# EAGLE design M903X (EAGLE 6.6.0)
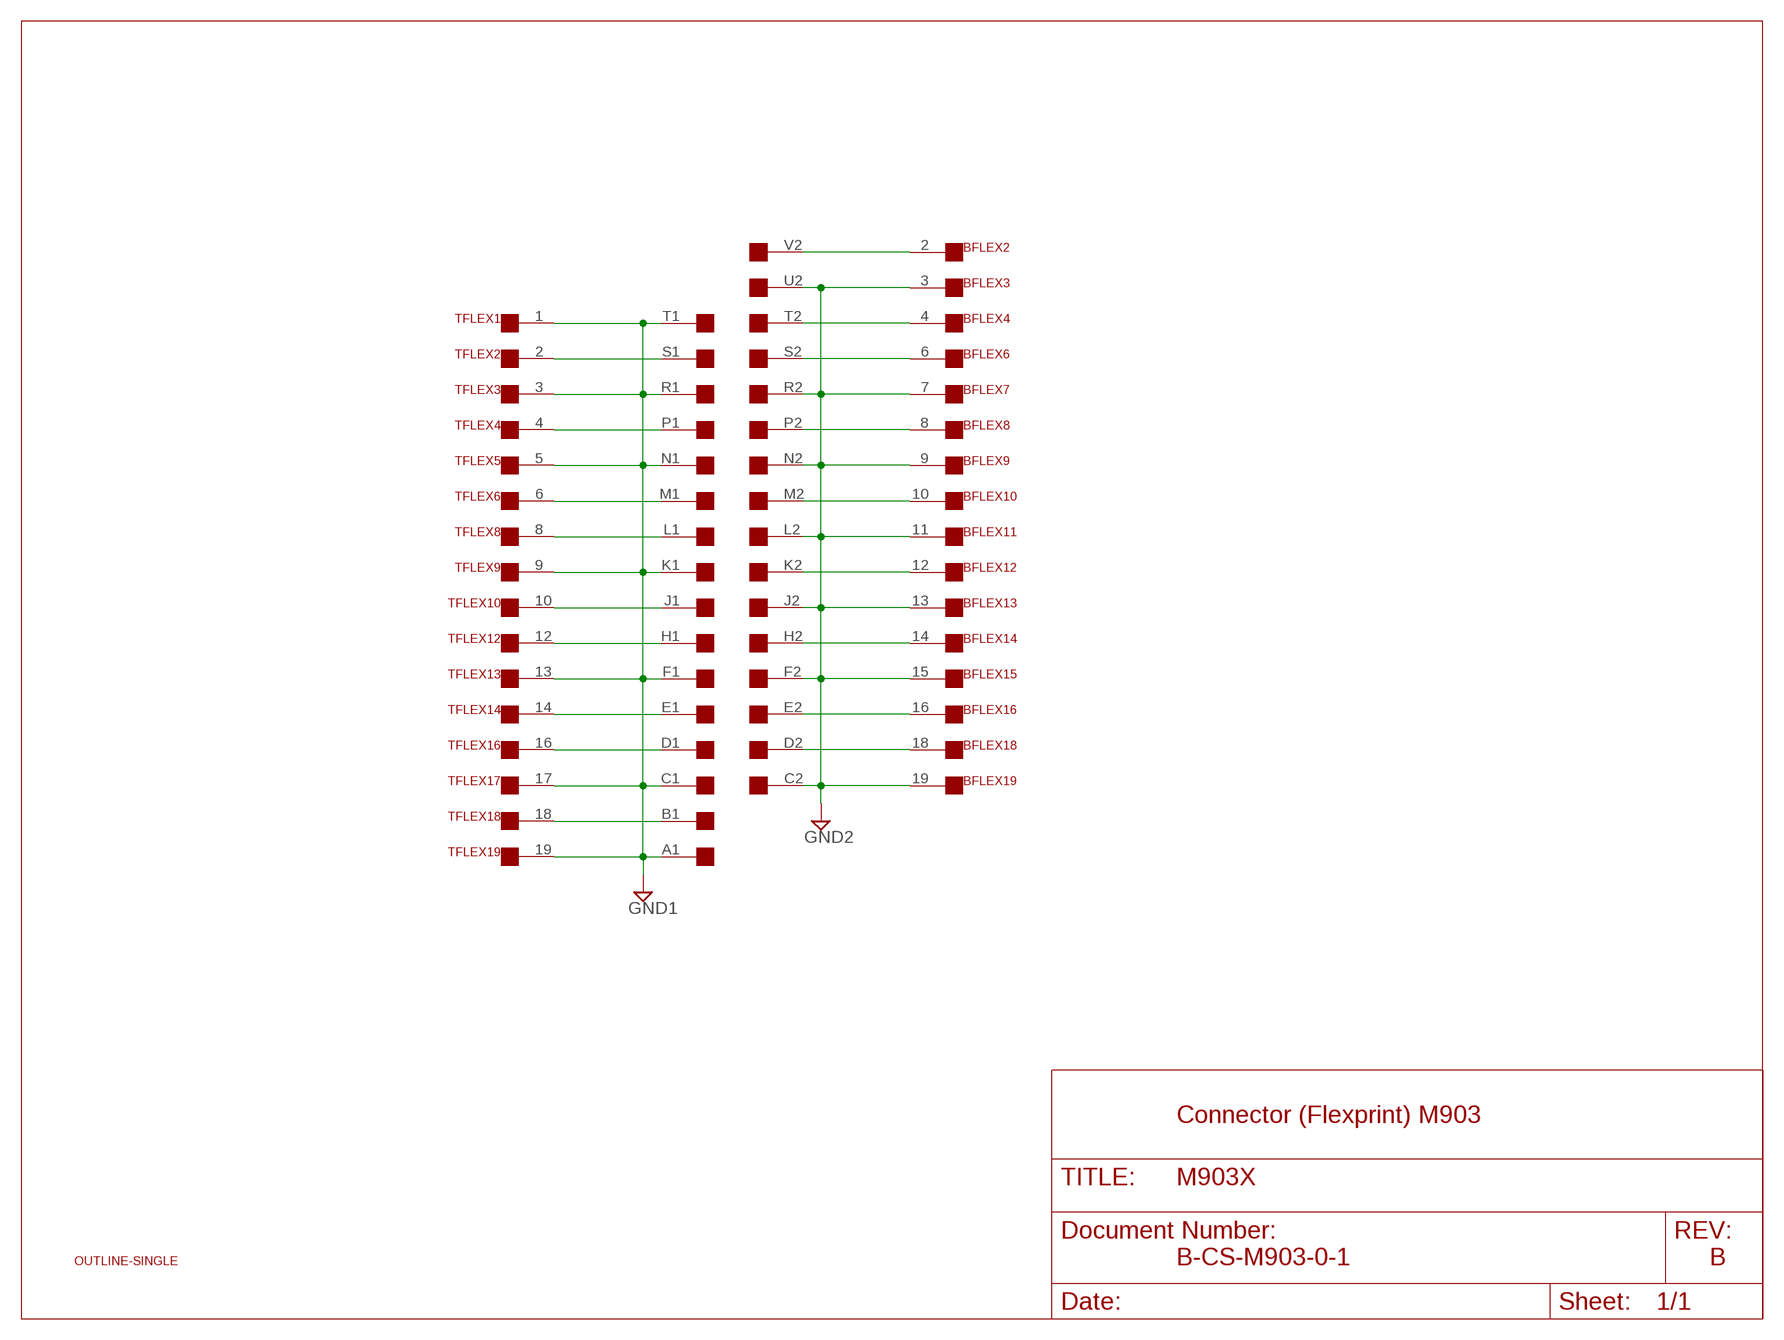
[diagram p0: schematic, sheet 1]

## Parts
BFLEX  FLEX19  [FLEX19]
TFLEX  FLEX19  [FLEX19]
U$1  SINGLE  [EDGE-CON2]
U$2  OUTLINE-SINGLE  [SINGLE]

## Nets
GND1: TFLEX.1 TFLEX.3 TFLEX.5 TFLEX.9 TFLEX.13 TFLEX.17 TFLEX.19 U$1.A1 U$1.C1 U$1.F1 U$1.K1 U$1.N1 U$1.R1 U$1.T1
GND2: BFLEX.3 BFLEX.7 BFLEX.9 BFLEX.11 BFLEX.13 BFLEX.15 BFLEX.19 U$1.C2 U$1.F2 U$1.J2 U$1.L2 U$1.N2 U$1.R2 U$1.U2
N$4: TFLEX.16 U$1.D1
N$5: TFLEX.14 U$1.E1
N$7: TFLEX.12 U$1.H1
N$8: TFLEX.10 U$1.J1
N$10: TFLEX.8 U$1.L1
N$11: TFLEX.6 U$1.M1
N$13: TFLEX.4 U$1.P1
N$15: TFLEX.2 U$1.S1
N$22: BFLEX.18 U$1.D2
N$23: BFLEX.16 U$1.E2
N$25: BFLEX.14 U$1.H2
N$27: BFLEX.12 U$1.K2
N$29: BFLEX.10 U$1.M2
N$31: BFLEX.8 U$1.P2
N$33: BFLEX.6 U$1.S2
N$34: BFLEX.4 U$1.T2
N$36: BFLEX.2 U$1.V2
N$42: TFLEX.18 U$1.B1
Unconnected: BFLEX.1 BFLEX.5 BFLEX.17 TFLEX.7 TFLEX.11 TFLEX.15 U$1.A2 U$1.B2 U$1.U1 U$1.V1

## Notes on the sheet
- Connector (Flexprint) M903
- B-CS-M903-0-1 | B

## Library data of the parts
BFLEX TFLEX = dec-con:FLEX19: 19 pin Flexprint Connection
U$1 = dec-con:SINGLE: Single-Height DEC board
U$2 = dec-con:OUTLINE-*: Board outlines for DEC boards.

## Board
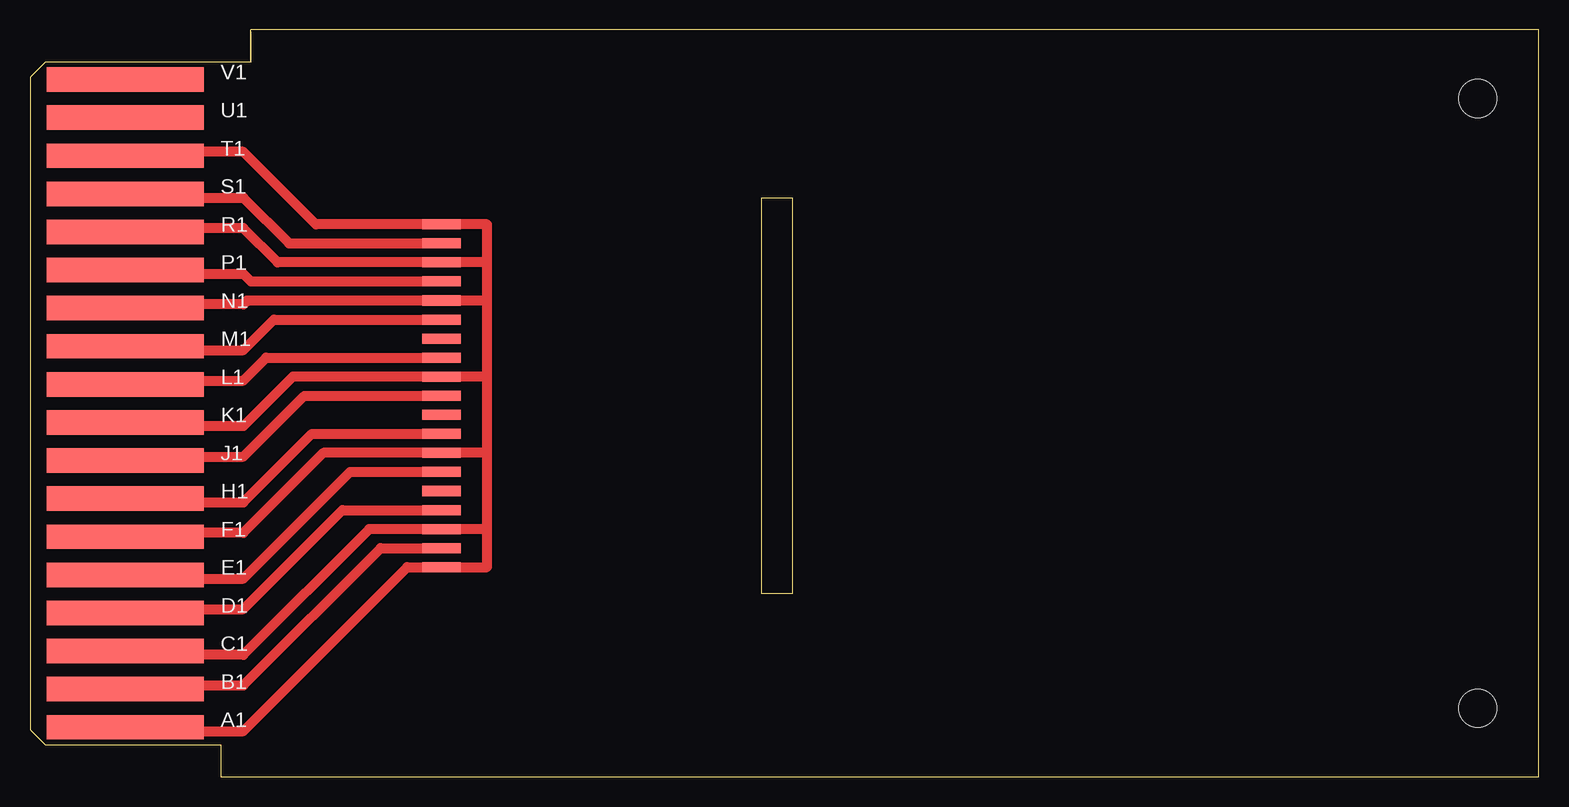
[diagram p1: board, top side]
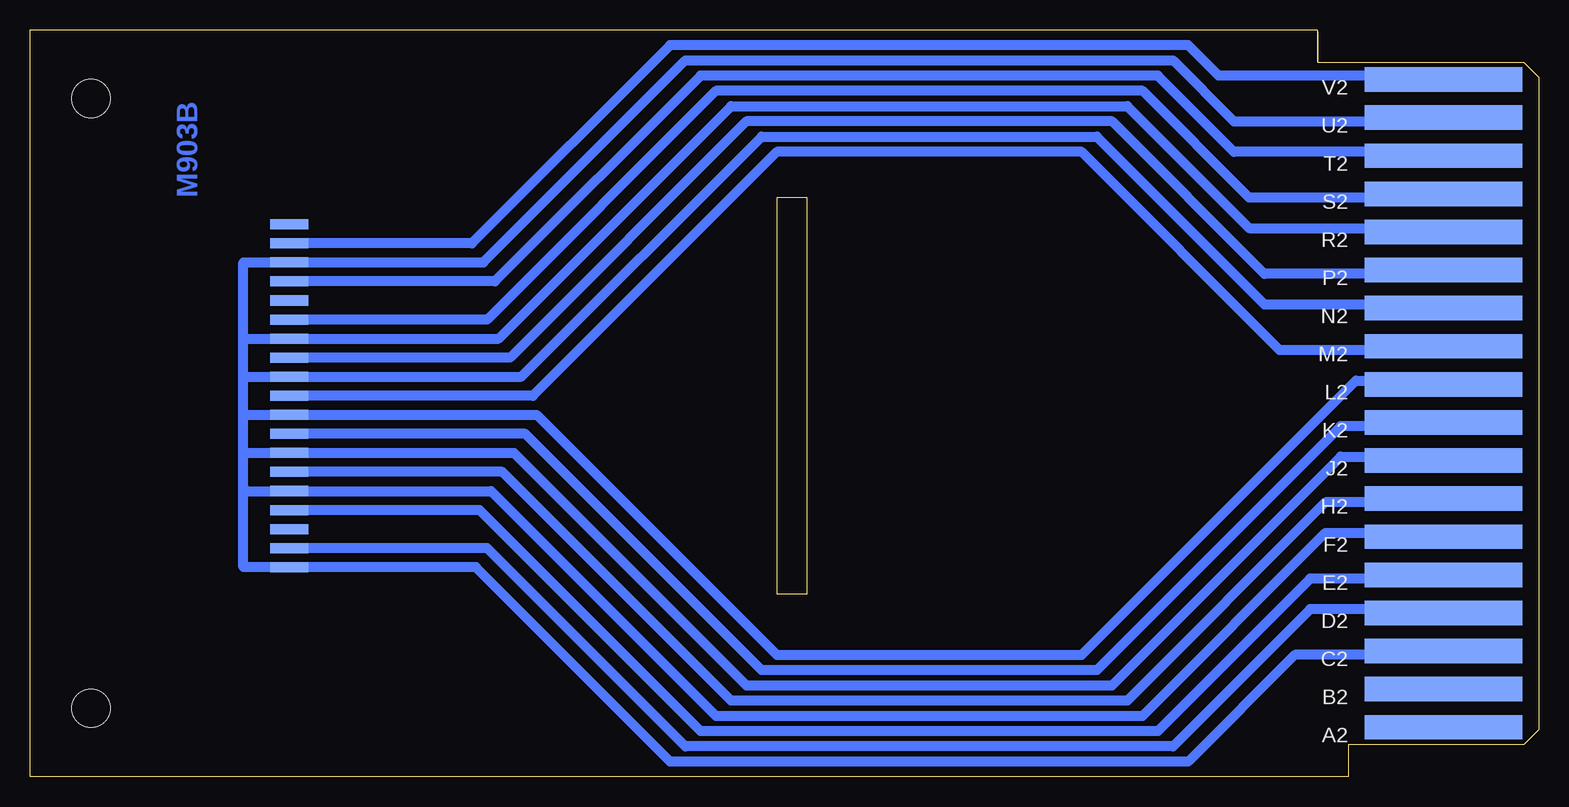
[diagram p2: board, bottom side, seen from below]

Size 125.73 x 62.23 mm. Coordinates in mm from the lower left corner, seen from the top.
Outline: 60.96,48.26 63.5,48.26 63.5,15.24 60.96,15.24 60.96,48.26
Copper layers (1+16): Top 0.035mm / dielectric 1.5mm / Bottom 0.035mm
Design rules "16mils": minimum track width 16mil, minimum drill 32mil, track to track 15mil, track to pad 10mil, pad to pad 10mil, via to via 10mil, smd to smd 10mil, copper to edge 13mil, drill to drill 10mil, minimum pad ring 10mil, minimum via ring 8mil, stop-mask expansion 0mil, vias tented up to drill 0mil, thermal gap 10mil

### Footprints (pad centres in the part's own frame; a part is rotated, then mirrored left to right if it is on the bottom)
FLEX19 = smd 3.175 x 0.838: 1 0,14.287; 2 0,12.7; 3 0,11.113; 4 0,9.525; 5 0,7.938; 6 0,6.35; 7 0,4.763; 8 0,3.175; 9 0,1.587; 10 0,0; 11 0,-1.587; 12 0,-3.175; 13 0,-4.763; 14 0,-6.35; 15 0,-7.938; 16 0,-9.525; 17 0,-11.113; 18 0,-12.7; 19 0,-14.287
EDGE-CON2 = smd 13.106 x 2.032: A1 7.938,4.128; B1 7.938,7.303; C1 7.938,10.477; D1 7.938,13.652; E1 7.938,16.828; F1 7.938,20.003; H1 7.938,23.177; J1 7.938,26.352; K1 7.938,29.527; L1 7.938,32.703; M1 7.938,35.877; N1 7.938,39.053; P1 7.938,42.227; R1 7.938,45.403; S1 7.938,48.578; T1 7.938,51.752; U1 7.938,54.928; V1 7.938,58.102 | smd 13.106 x 2.032 bottom: A2 7.938,4.128; B2 7.938,7.303; C2 7.938,10.477; D2 7.938,13.652; E2 7.938,16.828; F2 7.938,20.003; H2 7.938,23.177; J2 7.938,26.352; K2 7.938,29.527; L2 7.938,32.703; M2 7.938,35.877; N2 7.938,39.053; P2 7.938,42.227; R2 7.938,45.403; S2 7.938,48.578; T2 7.938,51.752; U2 7.938,54.928; V2 7.938,58.102
SINGLE = hole 3.175: 120.65,56.515; 120.65,5.715

### Placement (x,y rotation side)
BFLEX  104.14,31.75 0 bottom
TFLEX  34.29,31.75 0 top
U$1  0,0 0 top
U$2  0,0 0 top

### Tracks (layer width: path | path; a pad name or v marks a point on that pad's centre or on a via)
GND1
  Top 0.813: U$1.A1 8.26,3.81 17.78,3.81 31.43,17.46 TFLEX.19 38.1,17.46 38.1,20.64 | U$1.C1 8.26,10.16 17.78,10.16 28.26,20.64 TFLEX.17 38.1,20.64 | U$1.F1 8.26,20.32 17.78,20.32 24.45,26.99 TFLEX.13 38.1,26.99 | U$1.K1 8.26,29.21 17.78,29.21 21.91,33.34 TFLEX.9 38.1,33.34 | U$1.N1 8.26,39.37 17.78,39.37 18.1,39.69 TFLEX.5 38.1,39.69 | U$1.R1 8.26,45.72 17.78,45.72 20.64,42.86 TFLEX.3 38.1,42.86 | U$1.T1 8.26,52.07 17.78,52.07 23.81,46.04 TFLEX.1 38.1,46.04 38.1,42.86 | 38.1,20.64 38.1,26.99 | 38.1,26.99 38.1,33.34 | 38.1,33.34 38.1,39.69 | 38.1,39.69 38.1,42.86
GND2
  Bottom 0.813: U$1.C2 8.26,10.16 20.32,10.16 29.21,1.27 72.39,1.27 88.58,17.46 BFLEX.19 107.95,17.46 107.95,24.13 | U$1.F2 8.26,20.32 17.78,20.32 33.02,5.08 68.58,5.08 87.31,23.81 BFLEX.15 107.95,23.81 107.95,24.13 | U$1.J2 8.26,26.67 16.51,26.67 35.56,7.62 66.04,7.62 85.41,26.99 BFLEX.13 107.95,26.99 | U$1.L2 8.26,33.02 15.24,33.02 38.1,10.16 63.5,10.16 83.5,30.16 BFLEX.11 107.95,30.16 | U$1.N2 8.26,39.37 22.86,39.37 36.83,53.34 64.77,53.34 84.77,33.34 BFLEX.9 107.95,33.34 | U$1.R2 8.26,45.72 24.13,45.72 34.29,55.88 67.31,55.88 86.68,36.51 BFLEX.7 107.95,36.51 | U$1.U2 8.26,54.61 25.4,54.61 30.48,59.69 71.12,59.69 87.95,42.86 BFLEX.3 107.95,42.86 107.95,36.51 | 107.95,24.13 107.95,26.99 | 107.95,26.99 107.95,30.16 | 107.95,30.16 107.95,33.34 | 107.95,33.34 107.95,36.51
N$4
  Top 0.813: U$1.D1 8.26,13.97 17.78,13.97 26.04,22.23 TFLEX.16
N$5
  Top 0.813: U$1.E1 8.26,16.51 17.78,16.51 26.67,25.4 TFLEX.14
N$7
  Top 0.813: U$1.H1 8.26,22.86 17.78,22.86 23.5,28.57 TFLEX.12
N$8
  Top 0.813: U$1.J1 8.26,26.67 17.78,26.67 22.86,31.75 TFLEX.10
N$10
  Top 0.813: U$1.L1 8.26,33.02 17.78,33.02 19.69,34.92 TFLEX.8
N$11
  Top 0.813: U$1.M1 8.26,35.56 17.78,35.56 20.32,38.1 TFLEX.6
N$13
  Top 0.813: U$1.P1 8.26,41.91 17.78,41.91 18.42,41.27 TFLEX.4
N$15
  Top 0.813: U$1.S1 8.26,48.26 17.78,48.26 21.59,44.45 TFLEX.2
N$22
  Bottom 0.813: U$1.D2 8.26,13.97 19.05,13.97 30.48,2.54 71.12,2.54 87.63,19.05 BFLEX.18 104.46,19.05
N$23
  Bottom 0.813: U$1.E2 8.26,16.51 19.05,16.51 31.75,3.81 69.85,3.81 88.27,22.23 BFLEX.16
N$25
  Bottom 0.813: U$1.H2 8.26,22.86 17.78,22.86 34.29,6.35 67.31,6.35 86.36,25.4 BFLEX.14
N$27
  Bottom 0.813: U$1.K2 8.26,29.21 16.51,29.21 36.83,8.89 64.77,8.89 84.46,28.57 BFLEX.12
N$29
  Bottom 0.813: U$1.M2 8.26,35.56 21.59,35.56 38.1,52.07 63.5,52.07 83.82,31.75 BFLEX.10
N$31
  Bottom 0.813: U$1.P2 8.26,41.91 22.86,41.91 35.56,54.61 66.04,54.61 85.73,34.92 BFLEX.8
N$33
  Bottom 0.813: U$1.S2 8.26,48.26 24.13,48.26 33.02,57.15 68.58,57.15 87.63,38.1 BFLEX.6
N$34
  Bottom 0.813: U$1.T2 8.26,52.07 25.4,52.07 31.75,58.42 69.85,58.42 87,41.27 BFLEX.4
N$36
  Bottom 0.813: U$1.V2 8.26,58.42 26.67,58.42 29.21,60.96 72.39,60.96 88.9,44.45 BFLEX.2
N$42
  Top 0.813: U$1.B1 8.26,7.62 17.78,7.62 29.21,19.05 TFLEX.18

### Text on the board
Bottom: M903B
200bmp: C:/Users/Vince/Documents/websvn/trunk/Eagle/projects/DEC/Mxxx/M903/M903Bfrontb.bmp